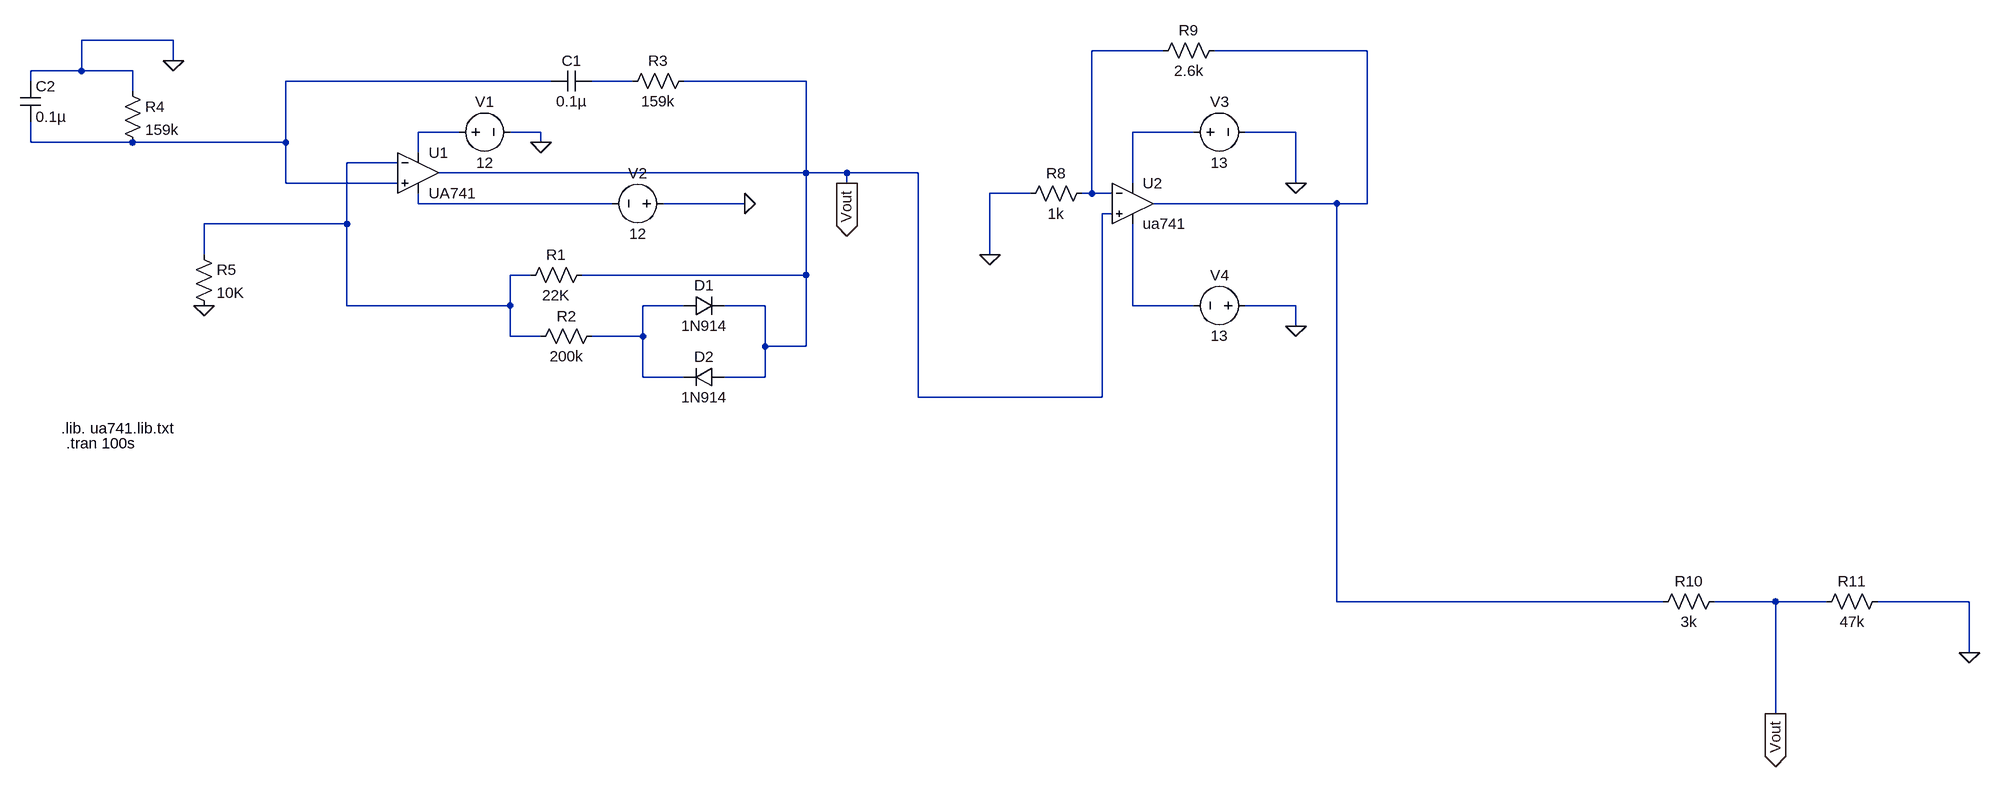
[diagram p0: schematic wien_bridge(20HZ_TO_100HZ)_with_square[1].asc]
wien_bridge(20HZ_TO_100HZ)_with_square[1].asc, the LTspice schematic file:
Version 4
SHEET 1 2692 1104
WIRE -144 -64 -288 -64
WIRE 1408 -48 1296 -48
WIRE 1728 -48 1488 -48
WIRE -144 -32 -144 -64
WIRE -288 -16 -288 -64
WIRE -288 -16 -368 -16
WIRE -208 -16 -288 -16
WIRE -368 0 -368 -16
WIRE 448 0 32 0
WIRE 576 0 512 0
WIRE 848 0 656 0
WIRE -208 16 -208 -16
WIRE 304 80 240 80
WIRE 432 80 384 80
WIRE 1456 80 1360 80
WIRE 1616 80 1536 80
WIRE -368 96 -368 64
WIRE -208 96 -368 96
WIRE 32 96 32 0
WIRE 32 96 -208 96
WIRE 432 96 432 80
WIRE 240 112 240 80
WIRE 208 128 128 128
WIRE 848 144 848 0
WIRE 848 144 272 144
WIRE 912 144 848 144
WIRE 1024 144 912 144
WIRE 32 160 32 96
WIRE 208 160 32 160
WIRE 912 160 912 144
WIRE 1360 160 1360 80
WIRE 1616 160 1616 80
WIRE 1200 176 1136 176
WIRE 1296 176 1296 -48
WIRE 1296 176 1280 176
WIRE 1328 176 1296 176
WIRE 240 192 240 176
WIRE 544 192 240 192
WIRE 752 192 624 192
WIRE 1680 192 1392 192
WIRE 1728 192 1728 -48
WIRE 1728 192 1680 192
WIRE 1328 208 1312 208
WIRE 128 224 128 128
WIRE 128 224 -96 224
WIRE -96 272 -96 224
WIRE 1136 272 1136 176
WIRE 416 304 384 304
WIRE 848 304 848 144
WIRE 848 304 496 304
WIRE 128 352 128 224
WIRE 384 352 384 304
WIRE 384 352 128 352
WIRE 656 352 592 352
WIRE 784 352 720 352
WIRE 1360 352 1360 224
WIRE 1456 352 1360 352
WIRE 1616 352 1536 352
WIRE 1616 384 1616 352
WIRE 384 400 384 352
WIRE 432 400 384 400
WIRE 592 400 592 352
WIRE 592 400 512 400
WIRE 784 416 784 352
WIRE 848 416 848 304
WIRE 848 416 784 416
WIRE 592 464 592 400
WIRE 656 464 592 464
WIRE 784 464 784 416
WIRE 784 464 720 464
WIRE 1024 496 1024 144
WIRE 1312 496 1312 208
WIRE 1312 496 1024 496
WIRE 1680 816 1680 192
WIRE 2192 816 1680 816
WIRE 2368 816 2272 816
WIRE 2448 816 2368 816
WIRE 2672 816 2528 816
WIRE 2672 896 2672 816
WIRE 2368 992 2368 816
FLAG -144 -32 0
FLAG -96 352 0
FLAG 432 96 0
FLAG 752 192 0
FLAG 912 160 Vout
IOPIN 912 160 Out
FLAG 1136 272 0
FLAG 1616 160 0
FLAG 1616 384 0
FLAG 2672 896 0
FLAG 2368 992 Vout
IOPIN 2368 992 Out
SYMBOL OpAmps\\opamp2 240 80 R0
SYMATTR InstName U1
SYMATTR Value UA741
SYMBOL res 512 288 R90
WINDOW 0 0 56 VBottom 2
WINDOW 3 32 56 VTop 2
SYMATTR InstName R1
SYMATTR Value 22K
SYMBOL res 528 384 R90
WINDOW 0 0 56 VBottom 2
WINDOW 3 32 56 VTop 2
SYMATTR InstName R2
SYMATTR Value 200k
SYMBOL diode 656 368 R270
WINDOW 0 32 32 VTop 2
WINDOW 3 0 32 VBottom 2
SYMATTR InstName D1
SYMATTR Value 1N914
SYMBOL diode 720 448 R90
WINDOW 0 0 32 VBottom 2
WINDOW 3 32 32 VTop 2
SYMATTR InstName D2
SYMATTR Value 1N914
SYMBOL res 672 -16 R90
WINDOW 0 0 56 VBottom 2
WINDOW 3 32 56 VTop 2
SYMATTR InstName R3
SYMATTR Value 159k
SYMBOL cap 512 -16 R90
WINDOW 0 0 32 VBottom 2
WINDOW 3 32 32 VTop 2
SYMATTR InstName C1
SYMATTR Value 0.1µ
SYMBOL cap -384 0 R0
SYMATTR InstName C2
SYMATTR Value 0.1µ
SYMBOL res -224 0 R0
SYMATTR InstName R4
SYMATTR Value 159k
SYMBOL res -112 256 R0
SYMATTR InstName R5
SYMATTR Value 10K
SYMBOL voltage 288 80 R270
WINDOW 0 32 56 VTop 2
WINDOW 3 -32 56 VBottom 2
WINDOW 123 0 0 Left 0
WINDOW 39 0 0 Left 0
SYMATTR InstName V1
SYMATTR Value 12
SYMBOL voltage 640 192 R90
WINDOW 0 -32 56 VBottom 2
WINDOW 3 32 56 VTop 2
WINDOW 123 0 0 Left 0
WINDOW 39 0 0 Left 0
SYMATTR InstName V2
SYMATTR Value 12
SYMBOL OpAmps\\ua741 1360 128 R0
SYMATTR InstName U2
SYMBOL res 1296 160 R90
WINDOW 0 0 56 VBottom 2
WINDOW 3 32 56 VTop 2
SYMATTR InstName R8
SYMATTR Value 1k
SYMBOL voltage 1440 80 R270
WINDOW 0 32 56 VTop 2
WINDOW 3 -32 56 VBottom 2
SYMATTR InstName V3
SYMATTR Value 13
SYMBOL voltage 1552 352 R90
WINDOW 0 -32 56 VBottom 2
WINDOW 3 32 56 VTop 2
SYMATTR InstName V4
SYMATTR Value 13
SYMBOL res 1504 -64 R90
WINDOW 0 0 56 VBottom 2
WINDOW 3 32 56 VTop 2
SYMATTR InstName R9
SYMATTR Value 2.6k
SYMBOL res 2288 800 R90
WINDOW 0 0 56 VBottom 2
WINDOW 3 32 56 VTop 2
SYMATTR InstName R10
SYMATTR Value 3k
SYMBOL res 2544 800 R90
WINDOW 0 0 56 VBottom 2
WINDOW 3 32 56 VTop 2
SYMATTR InstName R11
SYMATTR Value 47k
TEXT -320 544 Left 2 !.lib. ua741.lib.txt
TEXT -312 568 Left 2 !.tran 100s

The netlist it stands for:
* wien_bridge(20HZ_TO_100HZ)_with_square[1].asc
XU1 N003 N007 N005 N008 Vout UA741  ; pins In+ In- V+ V- OUT
R1 Vout N007 22K
R2 N009 N007 200k
D1 N009 Vout 1N914
D2 Vout N009 1N914
R3 Vout N004 159k
C1 N004 N003 0.1µ
C2 0 N003 0.1µ
R4 0 N003 159k
R5 N007 0 10K
V1 N005 0 12
V2 0 N008 12
XU2 Vout N001 N006 N010 N002 ua741  ; pins In+ In- V+ V- OUT
R8 N001 0 1k
V3 N006 0 13
V4 0 N010 13
R9 N002 N001 2.6k
R10 Vout N002 3k
R11 0 Vout 47k
.model D D
.lib standard.dio
.lib. ua741.lib.txt
.tran 100s
.backanno
.end